# Altium schematic sheet 直流电机驱动器.SchDoc
size A4
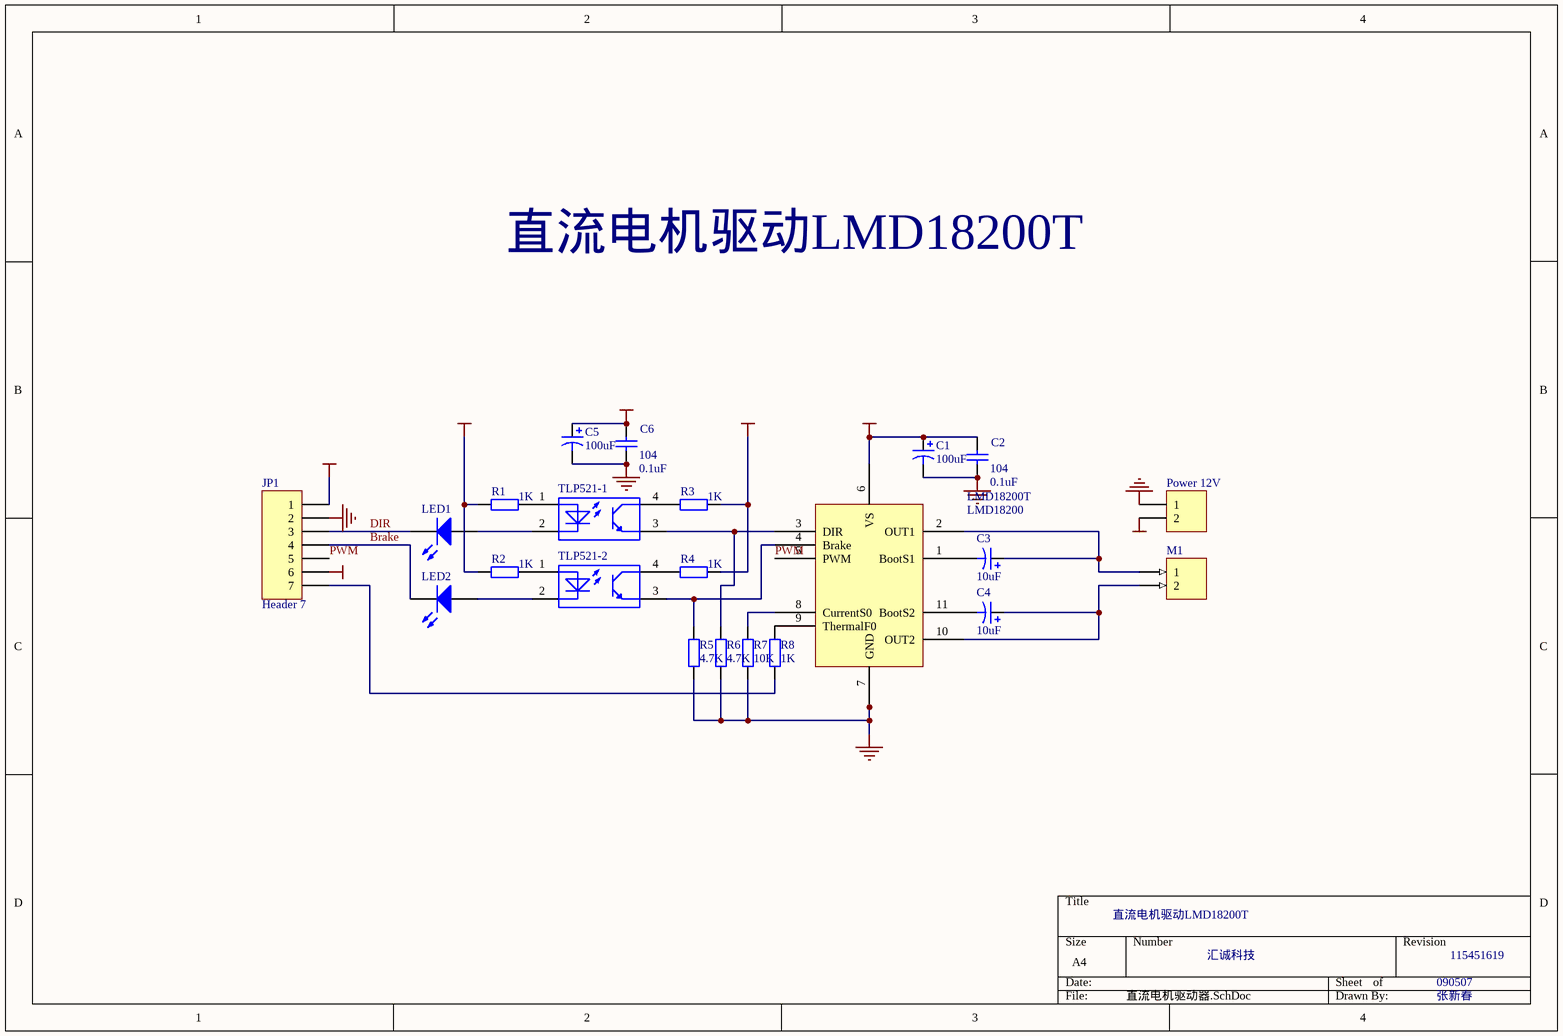
[diagram p0: 直流电机驱动器.SchDoc]

## Parts
C1  value 100uF  [DJDR_8mm]
C2  104  value 0.1uF  [CPDR]
C3  value 10uF  [DJDR_4mm]
C4  value 10uF  [DJDR_4mm]
C5  value 100uF  [DJDR_8mm]
C6  104  value 0.1uF  [CPDR]
JP1  Header 7  [HDR1X7]
LED1  (no value)  [HDR1X2]
LED2  (no value)  [HDR1X2]
LMD18200T  LMD18200  [LMD18200T]
M1  (no value)  [JK128]
Power_12V  (no value)  [JK128]
R1  value 1K  [HDR-2]
R2  value 1K  [HDR-2]
R3  value 1K  [HDR-2]
R4  value 1K  [HDR-2]
R5  value 4.7K  [HDR-2]
R6  value 4.7K  [HDR-2]
R7  value 10K  [HDR-2]
R8  value 1K  [HDR-2]
TLP521-1  (no value)  [DIP-4]
TLP521-2  (no value)  [DIP-4]

## Nets
+5V: C5.1 C6.2 JP1.1 JP1.6 R1.1 R2.1 R3.2 R4.2
GND: C1.2 C2.1 C5.2 C6.1 JP1.2 LMD18200T.7(GND) Power_12V.1 R5.1 R6.1 R7.1
VS: C1.1 C2.2 LMD18200T.6(VS) Power_12V.2
Brake: JP1.4 LED2.2(K)
DIR: JP1.3 LED1.2(K)
PWM: JP1.5 LMD18200T.5(PWM)
NetC3_1: C3.1 LMD18200T.2(OUT1) M1.1
NetC3_2: C3.2 LMD18200T.1(BootS1)
NetC4_1: C4.1 LMD18200T.10(OUT2) M1.2
NetC4_2: C4.2 LMD18200T.11(BootS2)
NetJP1_7: JP1.7 R8.2
NetLED1_1: LED1.1(A) TLP521-1.2
NetLED2_1: LED2.1(A) TLP521-2.2
NetLMD18200T_3: LMD18200T.3(DIR) R6.2 TLP521-1.3
NetLMD18200T_4: LMD18200T.4(Brake) R5.2 TLP521-2.3
NetLMD18200T_8: LMD18200T.8(CurrentS0) R7.2
NetLMD18200T_9: LMD18200T.9(ThermalF0) R8.1
NetR1_2: R1.2 TLP521-1.1
NetR2_2: R2.2 TLP521-2.1
NetR3_1: R3.1 TLP521-1.4
NetR4_1: R4.1 TLP521-2.4

## Notes on the sheet
- 直流电机驱动LMD18200T
- 汇诚科技
- 090507
- 115451619
- 张新春

## Library data of the parts
C1 C3-C5 = Cap Pol3: Polarized Capacitor (Surface Mount); Published: 8-Jun-2000; LatestRevisionDate: 17-Jul-2002; LatestRevisionNote: Re-released for DXP Platform.; PackageReference: C0805; Publisher: Altium Limited
C2 C6 = Cap: Capacitor; Published: 8-Jun-2000; LatestRevisionDate: 17-Jul-2002; LatestRevisionNote: Re-released for DXP Platform.; Publisher: Altium Limited
JP1 = Header 7: Header, 7-Pin; LatestRevisionDate: 17-Jul-2002; LatestRevisionNote: Re-released for DXP Platform.; Publisher: Altium Limited
LED1 LED2 = LED3: Typical BLUE SiC LED; Published: 8-Jun-2000; LatestRevisionDate: 17-Dec-2003; LatestRevisionNote: PCB Footprint replaced.; Publisher: Altium Limited
M1 Power_12V = MHDR1X2: Header, 2-Pin; LatestRevisionDate: 17-Jul-2002; LatestRevisionNote: Re-released for DXP Platform.; Publisher: Altium Limited
R1-R8 = Res2: Resistor; Published: 8-Jun-2000; LatestRevisionDate: 17-Jul-2002; LatestRevisionNote: Re-released for DXP Platform.; Publisher: Altium Limited
TLP521-1 TLP521-2 = TLP521-1